# EAGLE design LB_BIT_i37_mix_in-v03(1_1) (EAGLE 6.6.0)
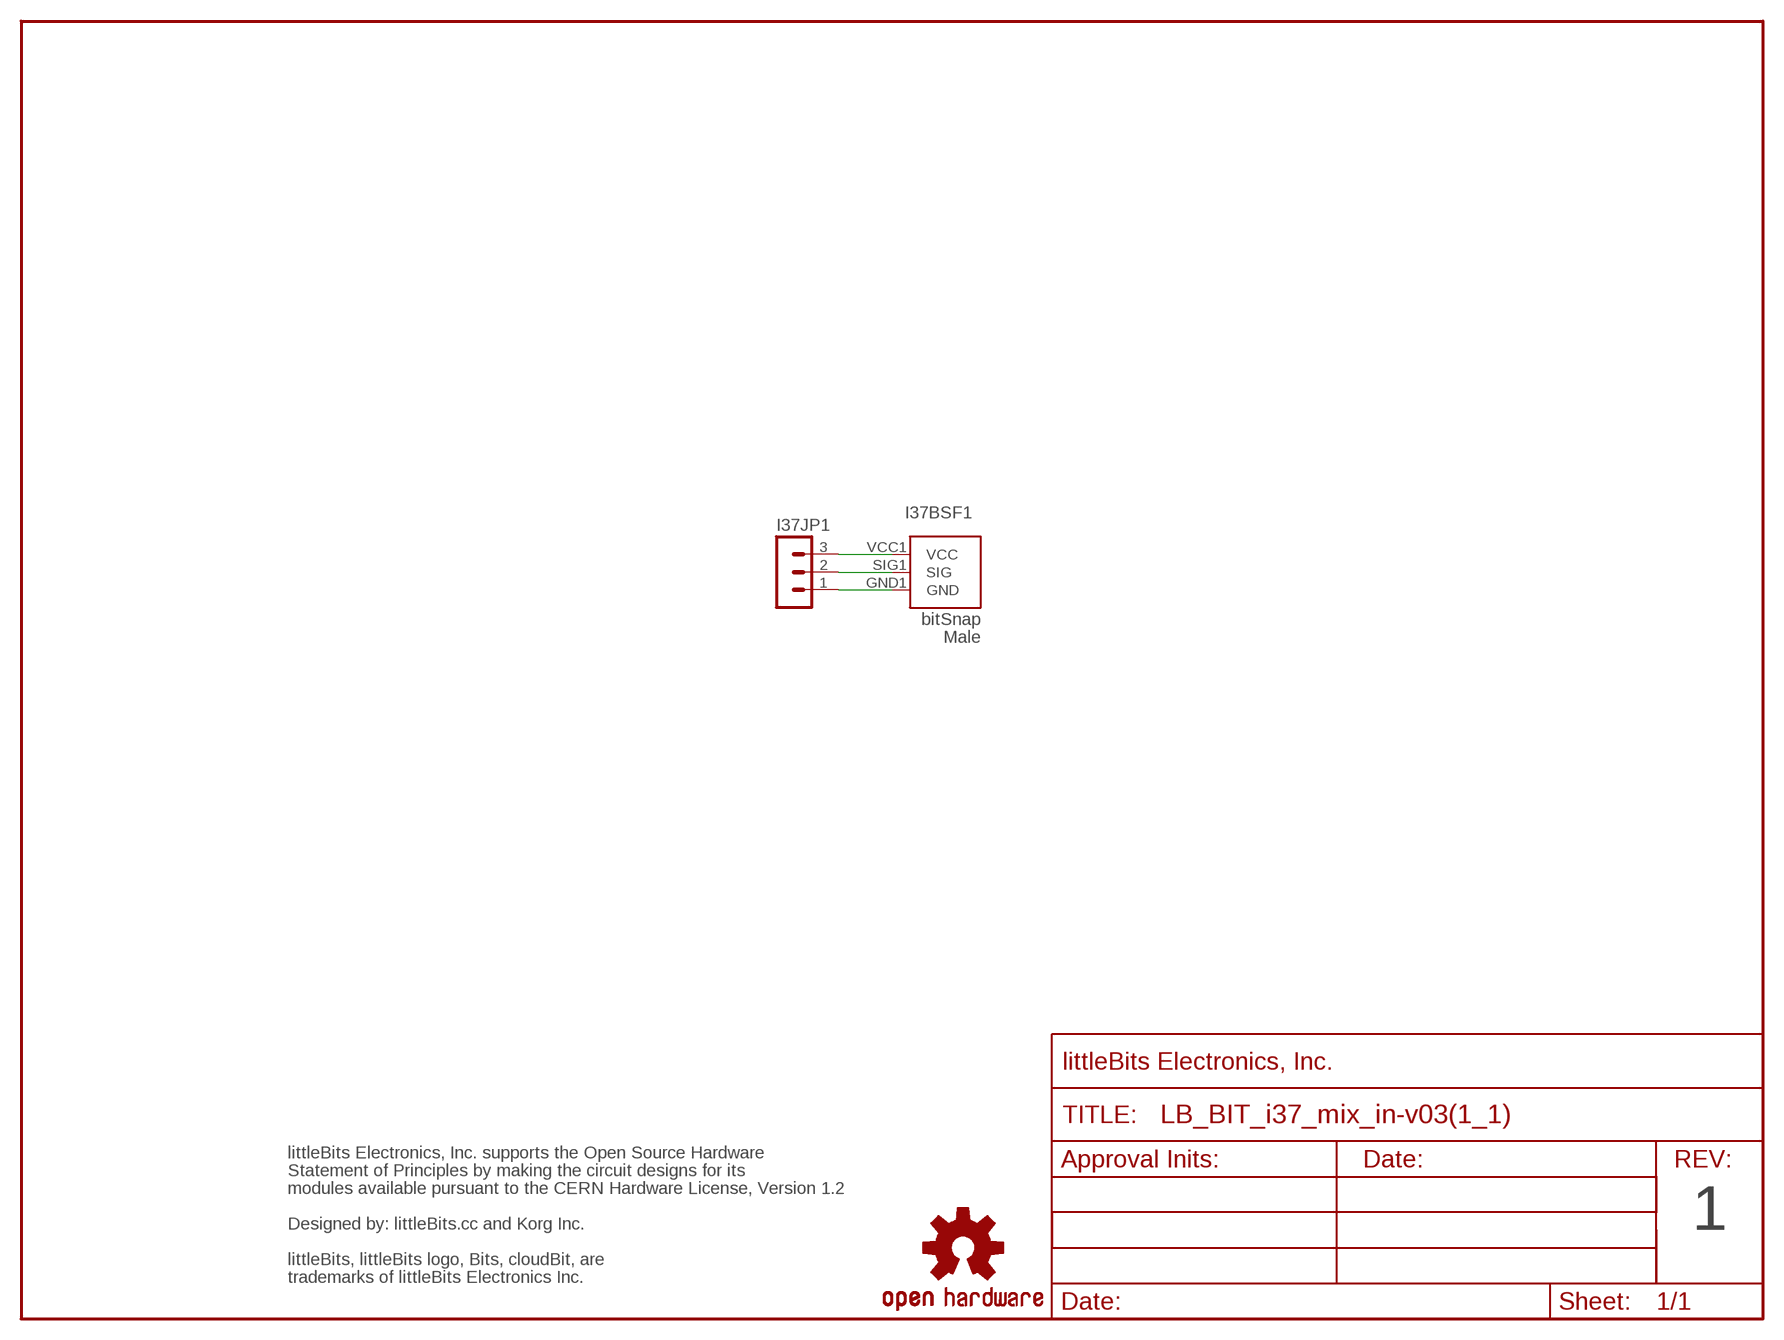
[diagram p0: schematic, sheet 1]

## Parts
I37BSF1  BITSNAP_V03_MALE  [BITSNAP_V03_MALE]
I37JP1  MA03-1SMD  [1X03-1MM-RA]
U$1  FRAME-LETTER-OHWOHW  [FABDWG01-OHW]
U$3  OSHW-LOGOL  [OSHW-LOGO-L]
U$4  OSHWCREDIT-KORG  [OSHWCREDIT-KORG]

## Nets
GND: I37BSF1.GND1(GND) I37JP1.1
SIG: I37BSF1.SIG1(SIG) I37JP1.2
VCC: I37BSF1.VCC1(VCC) I37JP1.3

## Notes on the sheet
- 1

## Library data of the parts
I37BSF1 = bitSnap:BITSNAP_V03_MALE
I37JP1 = LITTLEBITS:MA03-1: PIN HEADER
U$1 = LITTLEBITS:FRAME-LETTER-OHW
U$3 = SparkFun:OSHW-LOGO: Open Source Hardware Logo This logo indicates the piece of hardware it is found on incorporates a OSHW license and/or adheres to the definition of open source hardware found here: http://freedomdefined.org/OSHW
U$4 = LITTLEBITS:OSHWCREDIT-KORG

## Board
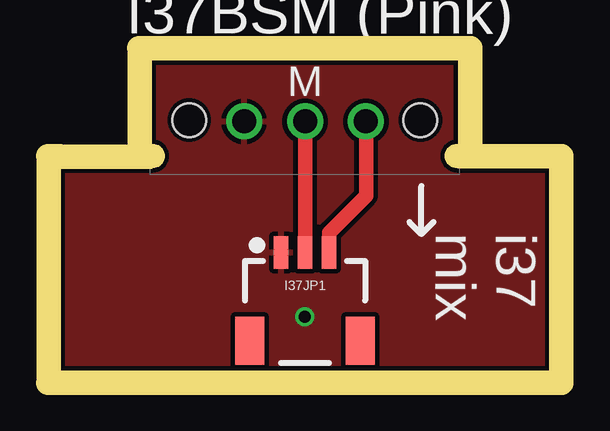
[diagram p1: board, top side]
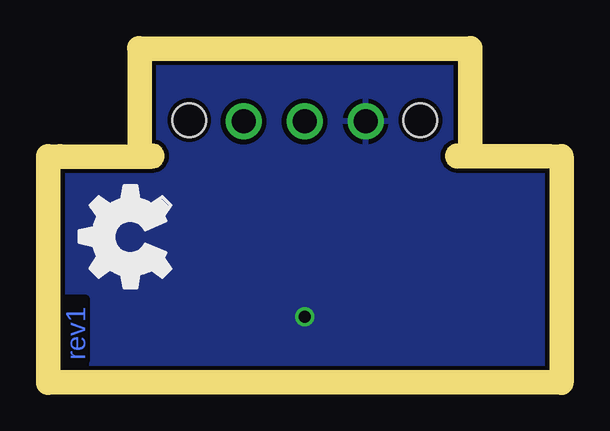
[diagram p2: board, bottom side, seen from below]

Size 20.4 x 12.95 mm. Coordinates in mm from the lower left corner, seen from the top.
Outline: 0,8.45 0,0 20.4,0 20.4,8.45
Copper layers (1*16): Top 0.035mm / dielectric 1.5mm / Bottom 0.035mm
Design rules "littleBitsDRC": minimum track width 0.2mm, minimum drill 0.4mm, track to track 0.2mm, track to pad 0.2mm, pad to pad 0.2mm, via to via 0.2mm, smd to smd 0mil, copper to edge 0.2mm, drill to drill 0.2mm, minimum pad ring 0.2mm, minimum via ring 0.15mm, stop-mask expansion 0.1mm, vias tented up to drill 0mil, thermal gap 0.2mm
Milling: 5 lines

### Footprints (pad centres in the part's own frame; a part is rotated, then mirrored left to right if it is on the bottom)
BITSNAP_V03_MALE = drill 1: GND1 8.98,2.56; SIG1 6.44,2.56; VCC1 3.9,2.56 | hole 1.4: 11.27,2.5; 1.63,2.5
1X03-1MM-RA = smd 0.6 x 1.35: 1 -1,0; 2 0,0; 3 1,0 | smd 1.2 x 2: NC1 2.3,-3.675; NC2 -2.3,-3.675

### Placement (x,y rotation side)
I37BSF1  16.65,12.95 180 top
I37JP1  10.21,4.93 0 top
U$1  0,0 0 top
U$2  [OSHW_FILLX150_NOTEXT]  15.79,2.63 0 top
U$3  -25.34,-72.09 0 top  (outside the outline)
U$4  -77.35,-72.25 0 top  (outside the outline)

### Tracks (layer width: path | path; a pad name or v marks a point on that pad's centre or on a via)
GND  (via drill 0.5)
  other vias: 10.2,2.25
  pour Top: 0.15,12.79 0.15,0.15 20.17,0.2 20.22,12.79
  pour Bottom: 0.15,12.8 20.25,12.8 20.25,0.15 0.15,0.15
SIG
  Top 0.61: I37JP1.2 I37BSF1.SIG1
VCC
  Top 0.61: I37JP1.3 11.21,5.76 12.75,7.3 I37BSF1.VCC1

### Text on the board
Bottom: rev1
tPlace: i37 / mix
tNames: I37BSM (Pink)
Milling: 1mm DIA. ROUTER PATH
dxf: 1 | Input PCBA for Mix Bit